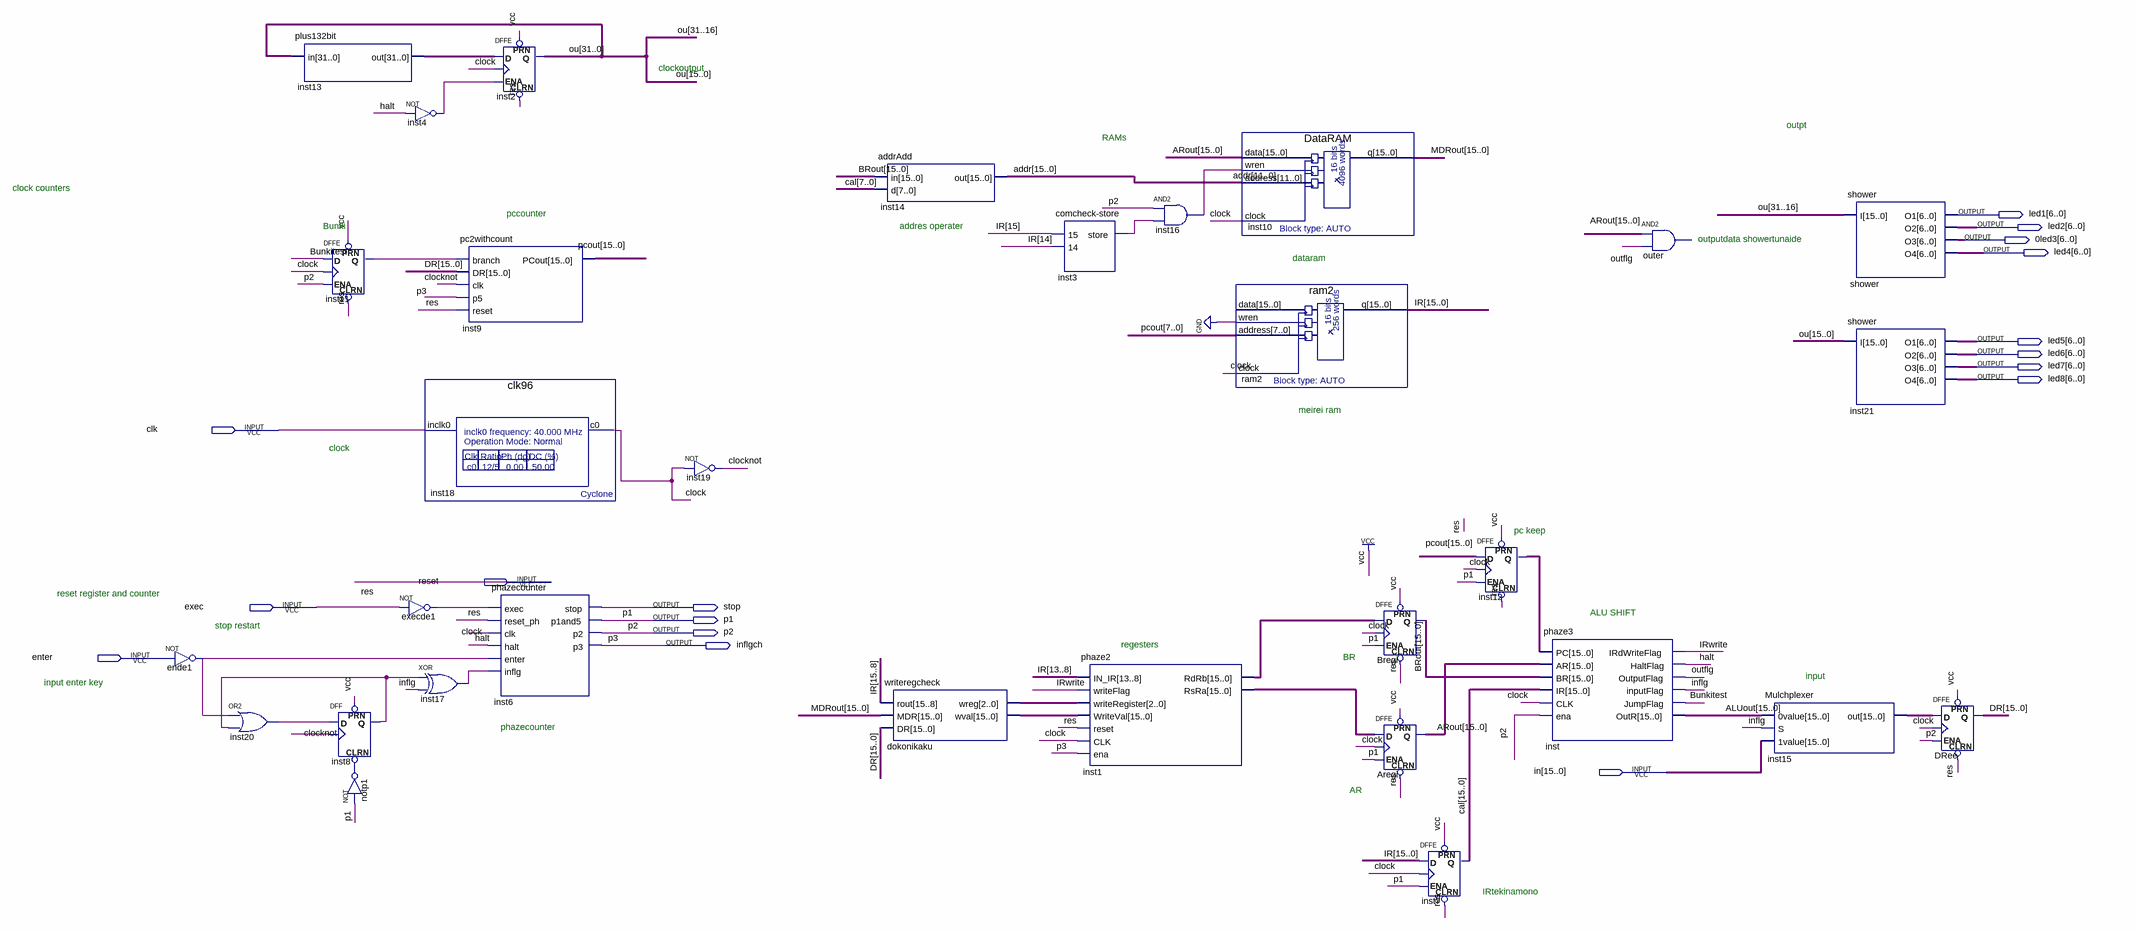
[diagram p0: schematic sheet]
// Quartus schematic jikken.bdf as structural Verilog: 31 symbols, 17 pins
module jikken (
  input  clk,
  input  reset,
  input  exec,
  input  enter,
  input  [15:0] in,
  output [6:0] led1,
  output [6:0] led2,
  output [6:0] \0led3 ,
  output [6:0] led4,
  output [6:0] led5,
  output [6:0] led6,
  output [6:0] led7,
  output [6:0] led8,
  output stop,
  output p1,
  output p2,
  output inflgch
);

  wire Bunkitest, clock, clocknot, ende1_out, execde1_out, halt, inflg, inst3_store, inst4_out, inst8_q,
       inst11_q, inst16_out, inst17_out, inst20_out, IRwrite, notp1_out, outflg;
  wire [2:0] dokonikaku_wreg;
  wire [15:0] addr, ALUout, ARout, BRout, cal, dokonikaku_wval, DR, inst1_rdrb, inst1_rsra, inst12_q,
       inst15_out, IR, MDRout, pcout;
  wire [31:0] inst13_out, ou;

  not ende1 (ende1_out, enter);
  or inst20 (inst20_out, ende1_out, inst8_q);
  plus132bit inst13 (.in(ou), .out(inst13_out));
  DFFE inst11 (.PRN(1'b1), .CLRN(reset), .D(Bunkitest), .CLK(clock), .ENA(p2), .Q(inst11_q));
  DFF inst8 (.CLRN(notp1_out), .CLK(clocknot), .D(inst20_out), .PRN(1'b1), .Q(inst8_q));
  not notp1 (notp1_out, p1);
  not inst4 (inst4_out, halt);
  not execde1 (execde1_out, exec);
  pc2withcount inst9 (.branch(inst11_q), .DR(DR), .clk(clocknot), .p5(inflgch), .reset(reset), .PCout(pcout));
  clk96 inst18 (.inclk0(clk), .c0(clock));
  xor inst17 (inst17_out, inst8_q, inflg);
  DFFE inst2[31:0] (.PRN(1'b1), .CLRN(reset), .D(inst13_out), .CLK(clock), .ENA(inst4_out), .Q(ou));
  phazecounter inst6 (
    .exec(execde1_out), .reset_ph(reset), .clk(clock), .halt(halt), .enter(ende1_out), .inflg(inst17_out),
    .stop(stop), .p1and5(p1), .p2(p2), .p3(inflgch));
  not inst19 (clocknot, clock);
  addrAdd inst14 (.in(BRout), .d(cal[7:0]), .out(addr));
  writeregcheck dokonikaku (.rout(IR[15:8]), .MDR(MDRout), .DR(DR), .wreg(dokonikaku_wreg), .wval(dokonikaku_wval));
  \comcheck-store  inst3 (.\15 (IR[15]), .\14 (IR[14]), .store(inst3_store));
  phaze2 inst1 (
    .IN_IR(IR[13:8]), .writeFlag(IRwrite), .writeRegister(dokonikaku_wreg), .WriteVal(dokonikaku_wval),
    .reset(reset), .CLK(clock), .ena(inflgch), .RdRb(inst1_rdrb), .RsRa(inst1_rsra));
  and inst16 (inst16_out, p2, inst3_store);
  DataRAM inst10 (.data(ARout), .wren(inst16_out), .address(addr[11:0]), .clock(clock), .q(MDRout));
  ram2 ram2 (.wren(1'b0), .address(pcout[7:0]), .clock(clock), .q(IR));  // open: data
  DFFE Bregi[15:0] (.PRN(1'b1), .CLRN(reset), .D(inst1_rdrb), .CLK(clock), .ENA(p1), .Q(BRout));
  DFFE Aregi[15:0] (.PRN(1'b1), .CLRN(reset), .D(inst1_rsra), .CLK(clock), .ENA(p1), .Q(ARout));
  DFFE inst7[15:0] (.PRN(1'b1), .CLRN(reset), .D(IR), .CLK(clock), .ENA(p1), .Q(cal));
  DFFE inst12[15:0] (.PRN(1'b1), .CLRN(reset), .D(pcout), .CLK(clock), .ENA(p1), .Q(inst12_q));
  phaze3 inst (
    .PC(inst12_q), .AR(ARout), .BR(BRout), .IR(cal), .CLK(clock), .ena(p2), .IRdWriteFlag(IRwrite),
    .HaltFlag(halt), .OutputFlag(outflg), .inputFlag(inflg), .JumpFlag(Bunkitest), .OutR(ALUout));
  // AND2 outer has open pins: IN1=ARout, IN2=outflg, OUT=open
  Mulchplexer inst15 (.\0value (ALUout), .S(inflg), .\1value (in), .out(inst15_out));
  shower shower (.I(ou[31:16]), .O1(led1), .O2(led2), .O3(\0led3 ), .O4(led4));
  shower inst21 (.I(ou[15:0]), .O1(led5), .O2(led6), .O3(led7), .O4(led8));
  DFFE DRee[15:0] (.PRN(1'b1), .CLRN(reset), .D(inst15_out), .CLK(clock), .ENA(p2), .Q(DR));

  // Other names for the same wires on the sheet: p3 = inflgch; res = reset

  // Notes on the sheet:
  //   clockoutput
  //   outpt
  //   RAMs
  //   clock counters
  //   pccounter
  //   Bunki
  //   addres operater
  //   outputdata showertunaide
  //   dataram
  //   meirei ram
  //   clock
  //   pc keep
  //   reset register and counter
  //   ALU SHIFT
  //   stop restart
  //   regesters
  //   BR
  //   input
  //   input enter key
  //   phazecounter
  //   AR
  //   IRtekinamono
endmodule
